# EAGLE design brain (EAGLE 9.5.2)

## Sheet 1 of 2
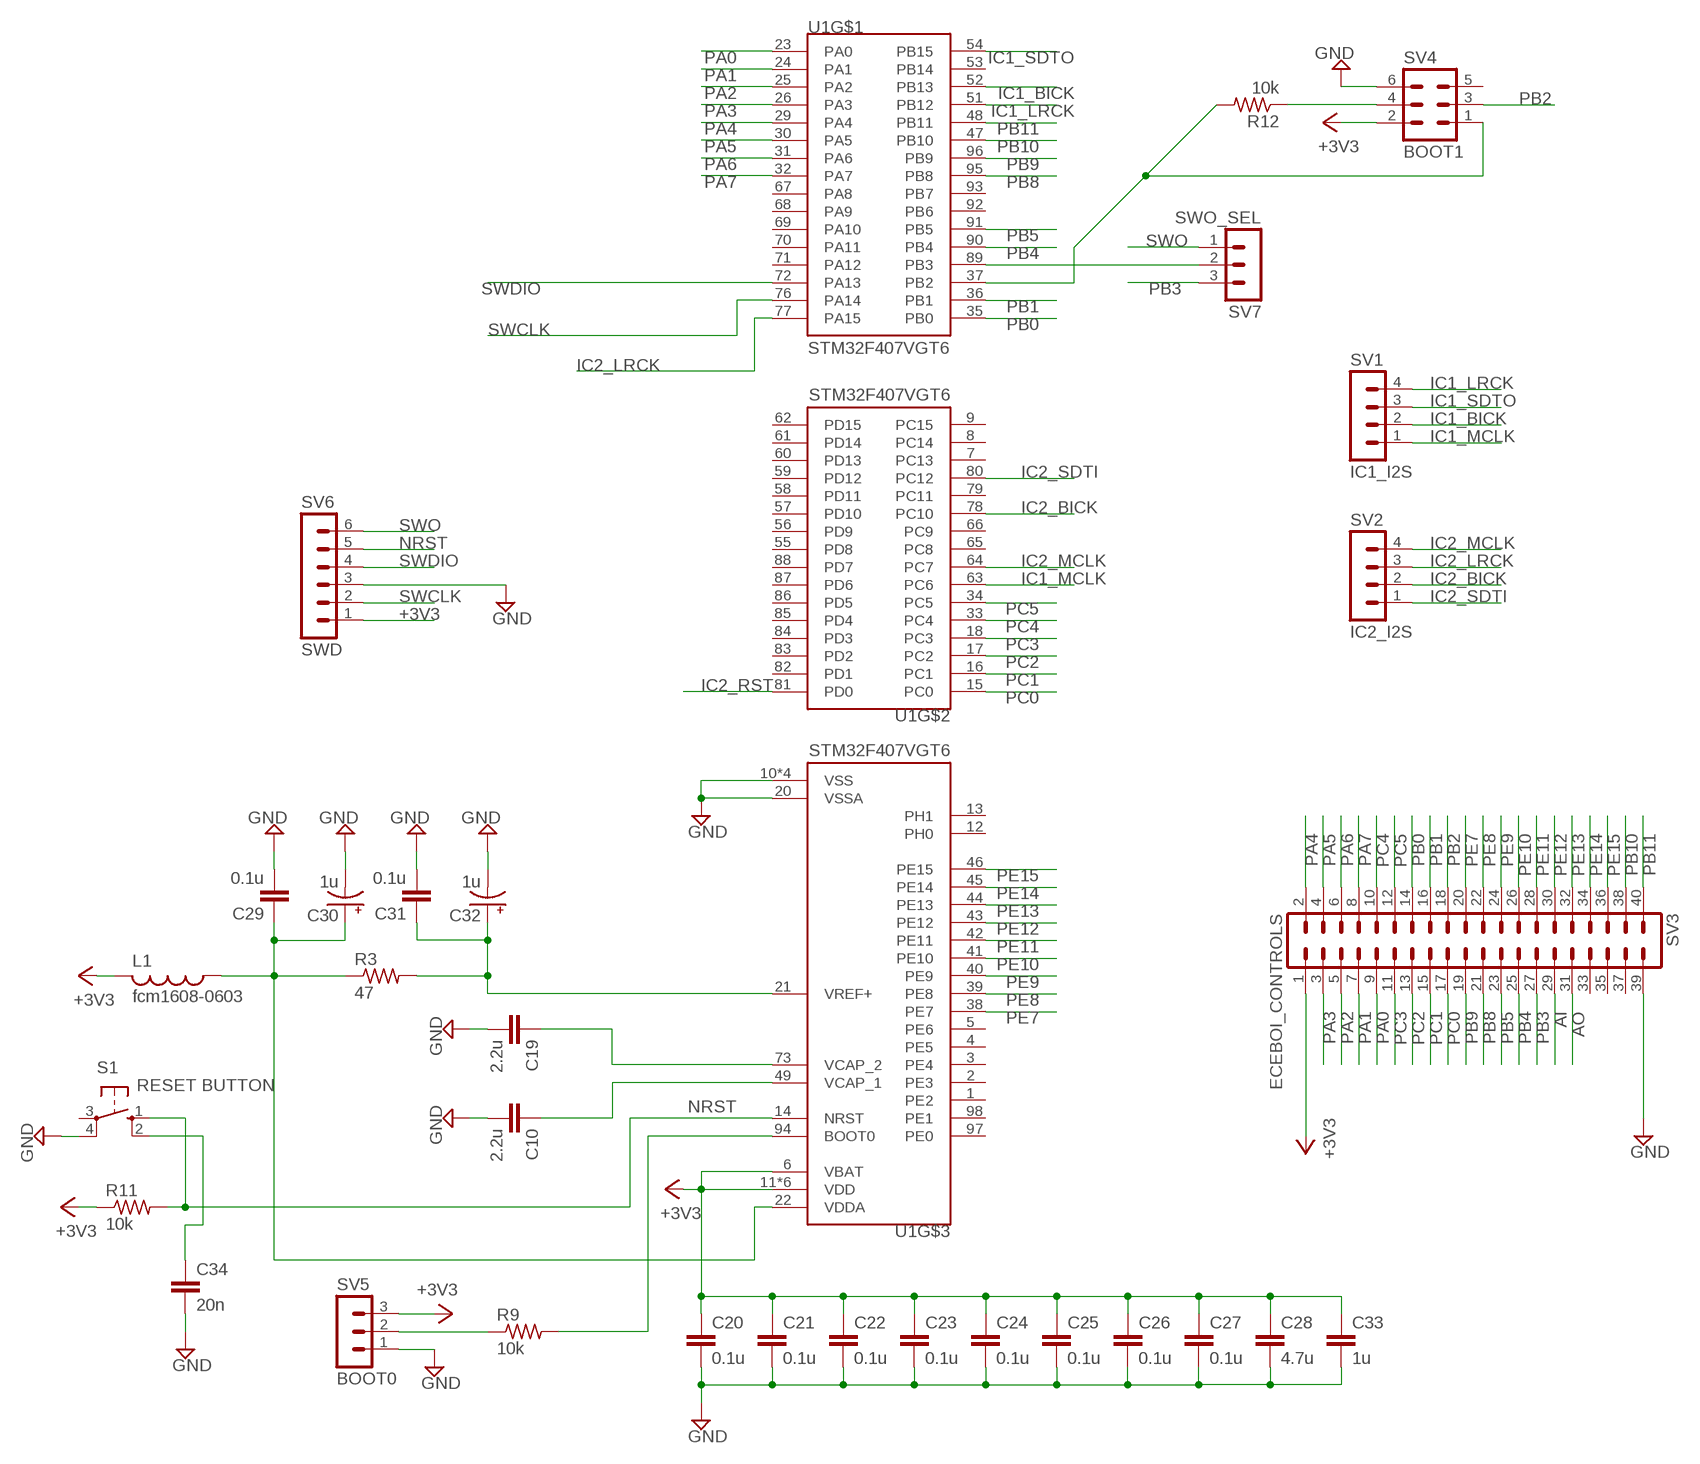
[diagram p0: schematic, sheet 1]

### Parts
C10  2.2u  C-EU025-024X044  [C025-024X044]
C19  2.2u  C-EU025-024X044  [C025-024X044]
C20  0.1u  C-EU025-024X044  [C025-024X044]
C21  0.1u  C-EU025-024X044  [C025-024X044]
C22  0.1u  C-EU025-024X044  [C025-024X044]
C23  0.1u  C-EU025-024X044  [C025-024X044]
C24  0.1u  C-EU025-024X044  [C025-024X044]
C25  0.1u  C-EU025-024X044  [C025-024X044]
C26  0.1u  C-EU025-024X044  [C025-024X044]
C27  0.1u  C-EU025-024X044  [C025-024X044]
C28  4.7u  C-EU025-024X044  [C025-024X044]
C29  0.1u  C-EU025-024X044  [C025-024X044]
C30  1u  CPOL-USE2-5  [E2-5]
C31  0.1u  C-EU025-024X044  [C025-024X044]
C32  1u  CPOL-USE2-5  [E2-5]
C33  1u  C-EU025-024X044  [C025-024X044]
C34  20n  C-EU025-024X044  [C025-024X044]
L1  fcm1608-0603  L-US0207/10  [0207/10]
R3  47  R-US_0207/10  [0207/10]
R9  10k  R-US_0207/10  [0207/10]
R11  10k  R-US_0207/10  [0207/10]
R12  10k  R-US_0207/10  [0207/10]
S1  RESET BUTTON  10-XX  [B3F-10XX]
SV1  IC1_I2S  MA04-1  [MA04-1]
SV2  IC2_I2S  MA04-1  [MA04-1]
SV3  ECEBOI_CONTROLS  MA20-2  [MA20-2]
SV4  BOOT1  MA03-2  [MA03-2]
SV5  BOOT0  MA03-1  [MA03-1]
SV6  SWD  MA06-1  [MA06-1]
SV7  SWO_SEL  MA03-1  [MA03-1]
U1  STM32F407VGT6  [QFP50P1600X1600X160-100N]

### Nets
+3V3: C20.1 C21.1 C22.1 C23.1 C24.1 C25.1 C26.1 C27.1 C28.1 C33.1 L1.2 R11.1 SV3.1 SV4.2 SV5.3 SV6.1 U1.6(VBAT) U1.11(VDD) U1.19(VDD) U1.28(VDD) U1.50(VDD) U1.75(VDD) U1.100(VDD) ; also sheet 2
AI: SV3.29 ; also sheet 2
AO: SV3.31 ; also sheet 2
GND: C10.2 C19.2 C20.2 C21.2 C22.2 C23.2 C24.2 C25.2 C26.2 C27.2 C28.2 C29.2 C30.- C31.2 C32.- C33.2 C34.2 S1.4(P1) SV3.39 SV4.6 SV5.1 SV6.3 U1.10(VSS) U1.20(VSSA) U1.27(VSS) U1.74(VSS) U1.99(VSS) ; also sheet 2
IC1_BICK: SV1.2 U1.52(PB13) ; also sheet 2
IC1_LRCK: SV1.4 U1.51(PB12) ; also sheet 2
IC1_MCLK: SV1.1 U1.63(PC6) ; also sheet 2
IC1_SDTO: SV1.3 U1.54(PB15) ; also sheet 2
IC2_BICK: SV2.2 U1.78(PC10) ; also sheet 2
IC2_LRCK: SV2.3 U1.77(PA15) ; also sheet 2
IC2_MCLK: SV2.4 U1.64(PC7) ; also sheet 2
IC2_RST: U1.81(PD0) ; also sheet 2
IC2_SDTI: SV2.1 U1.80(PC12) ; also sheet 2
N$9: R12.1 SV4.4
N$12: C10.1 U1.49(VCAP_1)
N$13: C19.1 U1.73(VCAP_2)
N$14: C29.1 C30.+ L1.1 R3.1 U1.22(VDDA)
N$15: C31.1 C32.+ R3.2 U1.21(VREF+)
N$19: R12.2 SV4.1 U1.37(PB2)
N$20: R9.1 SV5.2
N$21: R9.2 U1.94(BOOT0)
N$23: C34.1 S1.2(S1)
N$24: SV7.2 U1.89(PB3)
NRST: R11.2 S1.1(S) SV6.5 U1.14(NRST)
PA0: SV3.9 U1.23(PA0)
PA1: SV3.7 U1.24(PA1)
PA2: SV3.5 U1.25(PA2)
PA3: SV3.3 U1.26(PA3)
PA4: SV3.2 U1.29(PA4)
PA5: SV3.4 U1.30(PA5)
PA6: SV3.6 U1.31(PA6)
PA7: SV3.8 U1.32(PA7)
PB0: SV3.14 U1.35(PB0)
PB1: SV3.16 U1.36(PB1)
PB2: SV3.18 SV4.3
PB3: SV3.27 SV7.3
PB4: SV3.25 U1.90(PB4)
PB5: SV3.23 U1.91(PB5)
PB8: SV3.21 U1.95(PB8)
PB9: SV3.19 U1.96(PB9)
PB10: SV3.38 U1.47(PB10)
PB11: SV3.40 U1.48(PB11)
PC0: SV3.17 U1.15(PC0)
PC1: SV3.15 U1.16(PC1)
PC2: SV3.13 U1.17(PC2)
PC3: SV3.11 U1.18(PC3)
PC4: SV3.10 U1.33(PC4)
PC5: SV3.12 U1.34(PC5)
PE7: SV3.20 U1.38(PE7)
PE8: SV3.22 U1.39(PE8)
PE9: SV3.24 U1.40(PE9)
PE10: SV3.26 U1.41(PE10)
PE11: SV3.28 U1.42(PE11)
PE12: SV3.30 U1.43(PE12)
PE13: SV3.32 U1.44(PE13)
PE14: SV3.34 U1.45(PE14)
PE15: SV3.36 U1.46(PE15)
SWCLK: SV6.2 U1.76(PA14)
SWDIO: SV6.4 U1.72(PA13)
SWO: SV6.6 SV7.1
Unconnected: S1.3(P) SV3.33 SV3.35 SV3.37 SV4.5 U1.1(PE2) U1.2(PE3) U1.3(PE4) U1.4(PE5) U1.5(PE6) U1.7(PC13) U1.8(PC14) U1.9(PC15) U1.12(PH0) U1.13(PH1) U1.53(PB14) U1.55(PD8) U1.56(PD9) U1.57(PD10) U1.58(PD11) U1.59(PD12) U1.60(PD13) U1.61(PD14) U1.62(PD15) U1.65(PC8) U1.66(PC9) U1.67(PA8) U1.68(PA9) U1.69(PA10) U1.70(PA11) U1.71(PA12) U1.79(PC11) U1.82(PD1) U1.83(PD2) U1.84(PD3) U1.85(PD4) U1.86(PD5) U1.87(PD6) U1.88(PD7) U1.92(PB6) U1.93(PB7) U1.97(PE0) U1.98(PE1)

## Sheet 2 of 2
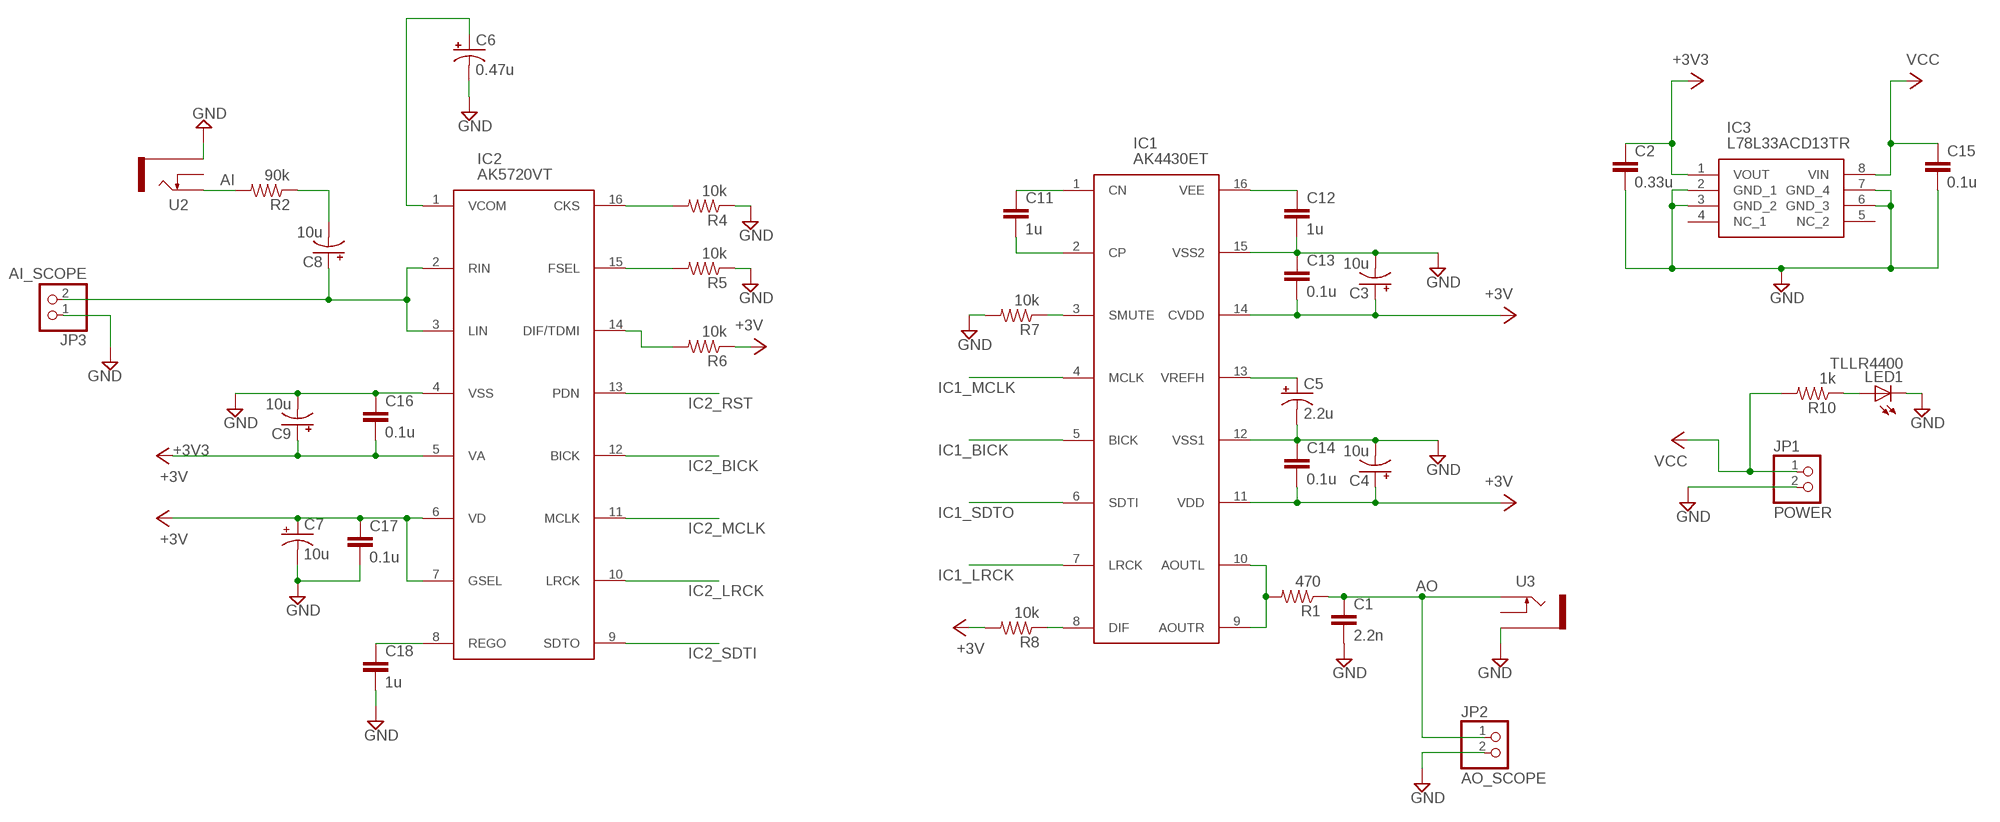
[diagram p1: schematic, sheet 2]

### Parts
C1  2.2n  C-EU025-024X044  [C025-024X044]
C2  0.33u  C-EU025-024X044  [C025-024X044]
C3  10u  CPOL-USE2-5  [E2-5]
C4  10u  CPOL-USE2-5  [E2-5]
C5  2.2u  CPOL-USE2-5  [E2-5]
C6  0.47u  CPOL-USE2-5  [E2-5]
C7  10u  CPOL-USE2-5  [E2-5]
C8  10u  CPOL-USE2-5  [E2-5]
C9  10u  CPOL-USE2-5  [E2-5]
C11  1u  C-EU025-024X044  [C025-024X044]
C12  1u  C-EU025-024X044  [C025-024X044]
C13  0.1u  C-EU025-024X044  [C025-024X044]
C14  0.1u  C-EU025-024X044  [C025-024X044]
C15  0.1u  C-EU025-024X044  [C025-024X044]
C16  0.1u  C-EU025-024X044  [C025-024X044]
C17  0.1u  C-EU025-024X044  [C025-024X044]
C18  1u  C-EU025-024X044  [C025-024X044]
IC1  AK4430ET  [SOP65P640X110-16N]
IC2  AK5720VT  [SOP65P640X110-16N]
IC3  L78L33ACD13TR  [SOIC127P600X175-8N]
JP1  POWER  PINHD-1X2  [1X02]
JP2  AO_SCOPE  PINHD-1X2  [1X02]
JP3  AI_SCOPE  PINHD-1X2  [1X02]
LED1  TLLR4400  [LED3MM]
R1  470  R-US_0207/10  [0207/10]
R2  90k  R-US_0207/10  [0207/10]
R4  10k  R-US_0207/10  [0207/10]
R5  10k  R-US_0207/10  [0207/10]
R6  10k  R-US_0207/10  [0207/10]
R7  10k  R-US_0207/10  [0207/10]
R8  10k  R-US_0207/10  [0207/10]
R10  1k  R-US_0207/10  [0207/10]
U2  THONKICONNNEW  [WQP-PJ301M-12_JACK]
U3  THONKICONNNEW  [WQP-PJ301M-12_JACK]

### Nets
+3V3: C2.1 C3.+ C4.+ C7.+ C9.+ C13.2 C14.2 C16.2 C17.1 IC1.11(VDD) IC1.14(CVDD) IC2.5(VA) IC2.6(VD) IC2.7(GSEL) IC3.1(VOUT) R6.1 R8.2 ; supply symbol labelled +3V ; also sheet 1
AI: R2.2 U2.P$1_TIP(TIP) ; also sheet 1
AO: C1.1 JP2.1 R1.1 U3.P$1_TIP(TIP) ; also sheet 1
DIF: IC2.14(DIF/TDMI) R6.2
GND: C1.2 C2.2 C3.- C4.- C5.- C6.- C7.- C9.- C12.2 C13.1 C14.1 C15.2 C16.1 C17.2 C18.2 IC1.12(VSS1) IC1.15(VSS2) IC2.4(VSS) IC3.2(GND_1) IC3.3(GND_2) IC3.6(GND_3) IC3.7(GND_4) JP1.2 JP2.2 JP3.1 LED1.K(C) R4.1 R5.1 R7.2 U2.P$3_SLEEVE(SLEEVE) U3.P$3_SLEEVE(SLEEVE) ; also sheet 1
IC1_BICK: IC1.5(BICK) ; also sheet 1
IC1_LRCK: IC1.7(LRCK) ; also sheet 1
IC1_MCLK: IC1.4(MCLK) ; also sheet 1
IC1_SDTO: IC1.6(SDTI) ; also sheet 1
IC2_BICK: IC2.12(BICK) ; also sheet 1
IC2_LRCK: IC2.10(LRCK) ; also sheet 1
IC2_MCLK: IC2.11(MCLK) ; also sheet 1
IC2_RST: IC2.13(PDN) ; also sheet 1
IC2_SDTI: IC2.9(SDTO) ; also sheet 1
N$1: C12.1 IC1.16(VEE)
N$2: C18.1 IC2.8(REGO)
N$3: C11.1 IC1.1(CN)
N$4: C11.2 IC1.2(CP)
N$5: C8.+ IC2.2(RIN) IC2.3(LIN) JP3.2
N$6: C6.+ IC2.1(VCOM)
N$7: IC1.9(AOUTR) IC1.10(AOUTL) R1.2
N$8: C5.+ IC1.13(VREFH)
N$10: C8.- R2.1
N$11: IC2.16(CKS) R4.2
N$16: IC2.15(FSEL) R5.2
N$17: IC1.8(DIF) R8.1
N$18: IC1.3(SMUTE) R7.1
N$22: LED1.A R10.1
VCC: C15.1 IC3.8(VIN) JP1.1 R10.2
Unconnected: IC3.4(NC_1) IC3.5(NC_2) U2.P$2_SWITCH(SWITCH) U3.P$2_SWITCH(SWITCH)

## Library data of the parts
C1 C2 C10-C29 C31 C33 C34 = rcl:C-EU: CAPACITOR, European symbol
C3-C9 C30 C32 = rcl:CPOL-US: POLARIZED CAPACITOR, American symbol
IC1 = AK4430ET:AK4430ET: DAC 2-CH Delta-Sigma 24-bit 16-Pin TSSOP Source: Datasheet <https://www.arrow.com/en/products/ak4430et/asahi-kasei-microdevices-corporation>; DESCRIPTION: DAC 2-CH Delta-Sigma 24-bit 16-Pin TSSOP; HEIGHT: 1.1mm; MANUFACTURER_NAME: AKM; MANUFACTURER_PART_NUMBER: AK4430ET
IC2 = AK5720VT:AK5720VT: 24-bit Audio ADC Source: Datasheet <http://www.akm.com/akm/en/file/datasheet/AK5720VT.pdf>; DESCRIPTION: 24-bit Audio ADC; HEIGHT: 1.1mm; MANUFACTURER_NAME: AKM; MANUFACTURER_PART_NUMBER: AK5720VT
IC3 = L78L33ACD13TR:L78L33ACD13TR: STMICROELECTRONICS - L78L33ACD13TR - Linear Voltage Regulators, Fixed, 8.3V To 30V In, 3.3V And 0.1A Out, SOIC-8 Source: Datasheet <https://componentsearchengine.com/Datasheets/2/L78L33ACD13TR.pdf>; DESCRIPTION: STMICROELECTRONICS - L78L33ACD13TR - Linear Voltage Regulators, Fixed, 8.3V To 30V In, 3.3V And 0.1A Out, SOIC-8; HEIGHT: 1.75mm; MANUFACTURER_NAME: STMicroelectronics; MANUFACTURER_PART_NUMBER: L78L33ACD13TR
JP1-JP3 = pinhead:PINHD-1X2: PIN HEADER
L1 = rcl:L-US: INDUCTOR, American symbol
LED1 = led:TLLR4400: Low Current (2mA) LED 3 mm Tinted Diffused Package color RED Source: Data sheet <http://www.farnell.com/datasheets/391100.pdf>; MF: VISHAY SEMICONDUCTOR; OC_FARNELL: 1612437
R1-R12 = rcl:R-US_: RESISTOR, American symbol
S1 = switch-omron:10-XX: OMRON SWITCH; MPN: B3F-1000; OC_FARNELL: 176432; OC_NEWARK: 36M3542
SV1 SV2 = con-lstb:MA04-1: PIN HEADER; OC_FARNELL: unknown; OC_NEWARK: unknown
SV3 = con-lstb:MA20-2: PIN HEADER; OC_FARNELL: unknown; OC_NEWARK: unknown
SV4 = con-lstb:MA03-2: PIN HEADER; OC_FARNELL: unknown; OC_NEWARK: unknown
SV5 SV7 = con-lstb:MA03-1: PIN HEADER; OC_FARNELL: unknown; OC_NEWARK: unknown
SV6 = con-lstb:MA06-1: PIN HEADER; OC_FARNELL: unknown; OC_NEWARK: unknown
U1 = STM32F407VGT6:STM32F407VGT6: STM32 Series 32-bit 1 MB Flash 192 kB RAM ARM Based Microcontroller - LQFP-100; DESCRIPTION: STM32 Series 32-bit 1 MB Flash 192 kB RAM ARM Based Microcontroller - LQFP-100; DIGI-KEY_PART_NUMBER: 497-11605-ND; DIGI-KEY_PURCHASE_URL: https://www.digikey.com/product-detail/en/stmicroelectronics/STM32F407VGT6/497-11605-ND/2747117?utm_source=snapeda&utm_medium=aggregator&utm_campaign=symbol; MF: STMicroelectronics; MP: STM32F407VGT6; PACKAGE: LQFP-100 STMicroelectronics
U2 U3 = MusicThingModular:THONKICONN: 3.5mm socket for Eurorack modular synths

## Board
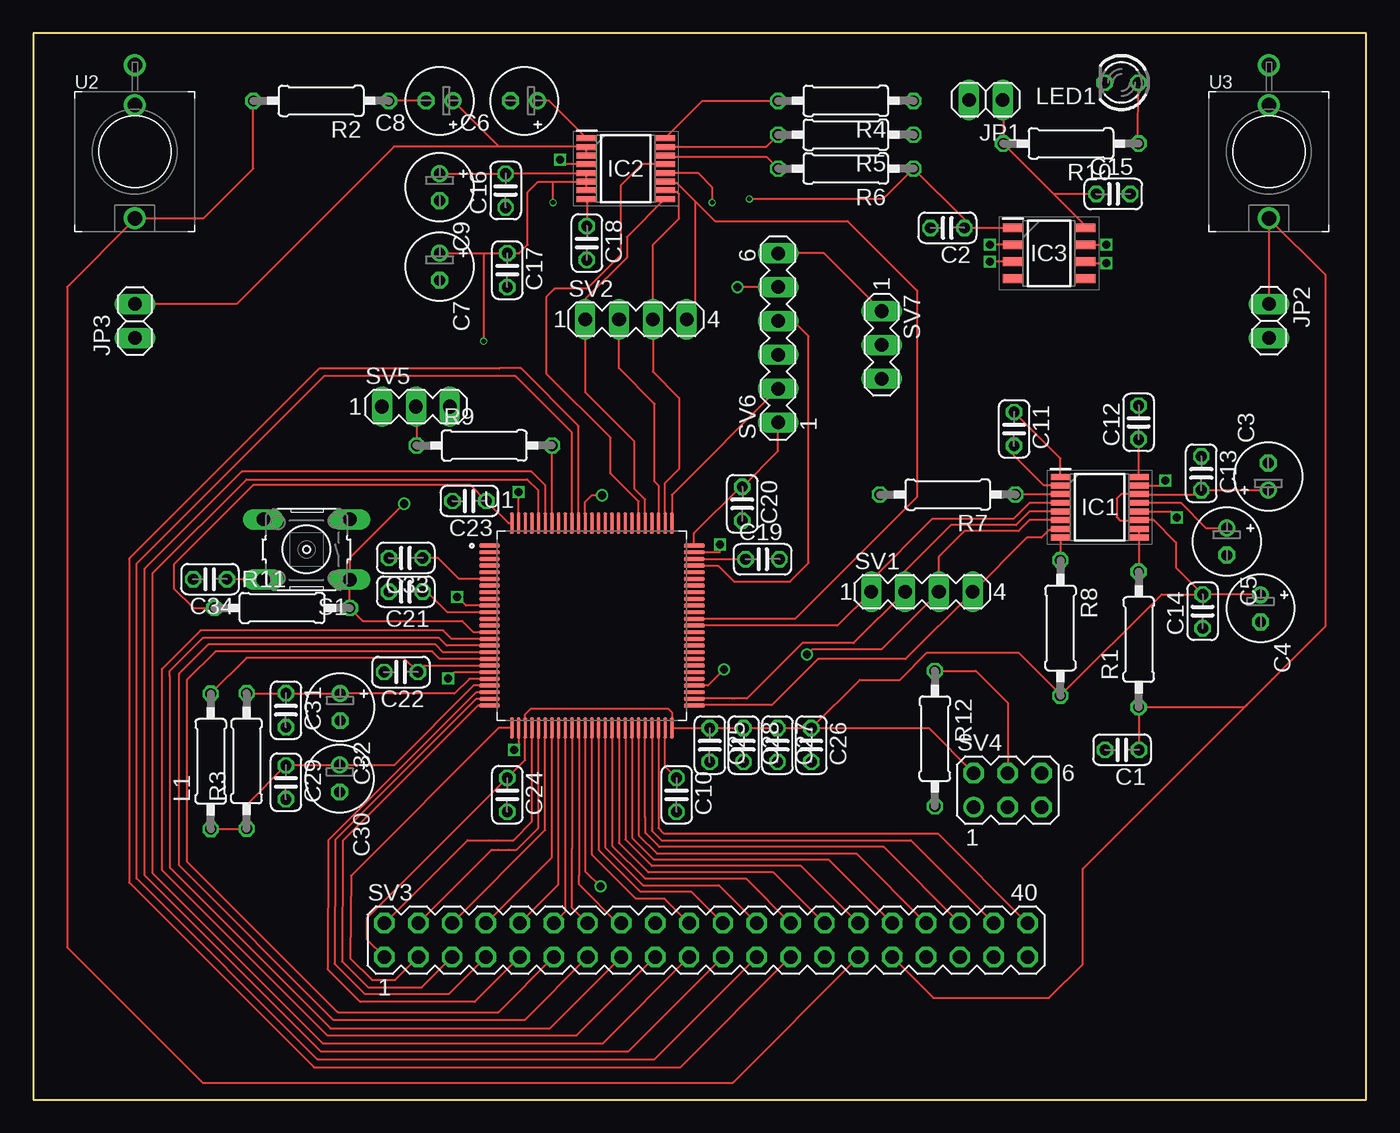
[diagram p2: board, top side]
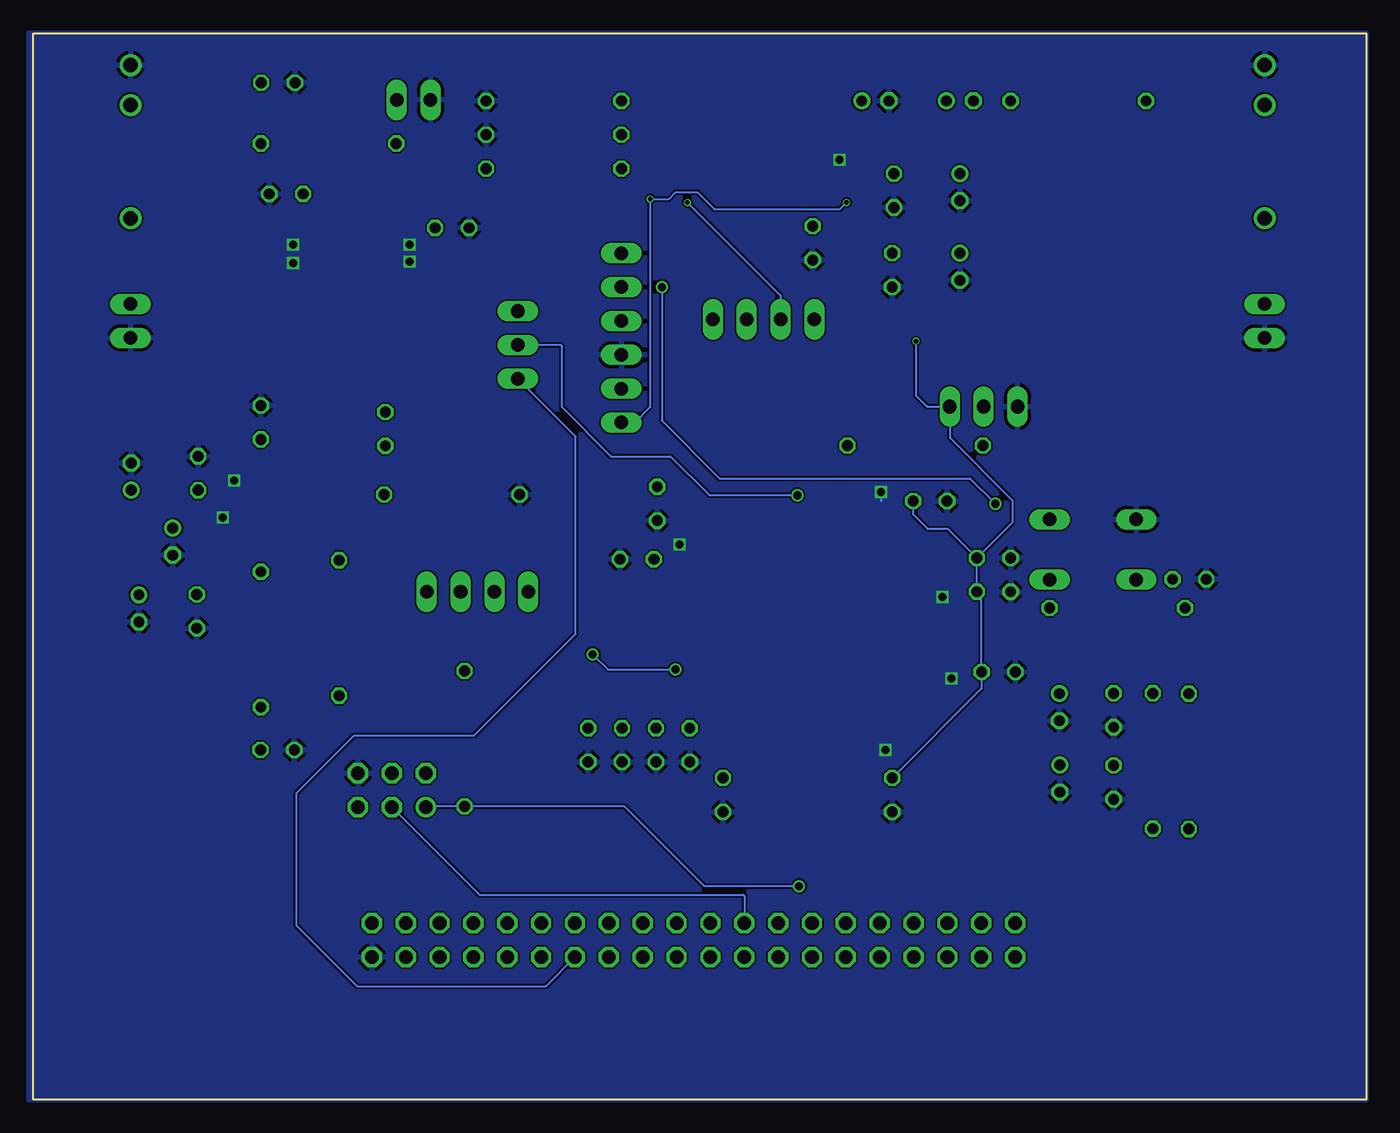
[diagram p3: board, bottom side, seen from below]

Size 100 x 80 mm. Coordinates in mm from the lower left corner, seen from the top.
Outline: 0,0 100,0 100,80 0,80 0,0
Copper layers (1*16): Top 0.035mm / dielectric 1.5mm / Bottom 0.035mm
Design rules "default *": minimum track width 5mil, minimum drill 0.2mm, track to track 5mil, track to pad 5mil, pad to pad 5mil, via to via 5mil, smd to smd 5mil, copper to edge 0mil, drill to drill 5mil, minimum pad ring 3mil, minimum via ring 3mil, stop-mask expansion 4mil, vias tented up to drill 0mil, thermal gap 10mil

### Footprints (pad centres in the part's own frame; a part is rotated, then mirrored left to right if it is on the bottom)
C025-024X044 = drill 0.813 octagon: 1 -1.27,0; 2 1.27,0
E2-5 = drill 0.813 pad 1.27: + -1.016,0 | drill 0.813 pad 1.27 octagon: - 1.016,0
SOP65P640X110-16N = smd 1.475 x 0.45: 1 -2.938,2.275; 2 -2.938,1.625; 3 -2.938,0.975; 4 -2.938,0.325; 5 -2.938,-0.325; 6 -2.938,-0.975; 7 -2.938,-1.625; 8 -2.938,-2.275; 9 2.938,-2.275; 10 2.938,-1.625; 11 2.938,-0.975; 12 2.938,-0.325; 13 2.938,0.325; 14 2.938,0.975; 15 2.938,1.625; 16 2.938,2.275
SOIC127P600X175-8N = smd 1.525 x 0.65: 1 -2.712,1.905; 2 -2.712,0.635; 3 -2.712,-0.635; 4 -2.712,-1.905; 5 2.712,-1.905; 6 2.712,-0.635; 7 2.712,0.635; 8 2.712,1.905
1X02 = drill 1.016 long: 1 -1.27,0; 2 1.27,0
0207/10 = drill 0.813 octagon: 1 -5.08,0; 2 5.08,0
LED3MM = drill 0.813 octagon: A -1.27,0; K 1.27,0
B3F-10XX = drill 1.016 long: 1 -3.251,2.261; 2 3.251,2.261; 3 -3.251,-2.261; 4 3.251,-2.261
MA04-1 = drill 1.016 long: 1 -3.81,0; 2 -1.27,0; 3 1.27,0; 4 3.81,0
MA20-2 = drill 1.016 octagon: 1 -24.13,-1.27; 2 -24.13,1.27; 3 -21.59,-1.27; 4 -21.59,1.27; 5 -19.05,-1.27; 6 -19.05,1.27; 7 -16.51,-1.27; 8 -16.51,1.27; 9 -13.97,-1.27; 10 -13.97,1.27; 11 -11.43,-1.27; 12 -11.43,1.27; 13 -8.89,-1.27; 14 -8.89,1.27; 15 -6.35,-1.27; 16 -6.35,1.27; 17 -3.81,-1.27; 18 -3.81,1.27; 19 -1.27,-1.27; 20 -1.27,1.27; 21 1.27,-1.27; 22 1.27,1.27; 23 3.81,-1.27; 24 3.81,1.27; 25 6.35,-1.27; 26 6.35,1.27; 27 8.89,-1.27; 28 8.89,1.27; 29 11.43,-1.27; 30 11.43,1.27; 31 13.97,-1.27; 32 13.97,1.27; 33 16.51,-1.27; 34 16.51,1.27; 35 19.05,-1.27; 36 19.05,1.27; 37 21.59,-1.27; 38 21.59,1.27; 39 24.13,-1.27; 40 24.13,1.27
MA03-2 = drill 1.016: 1 -2.54,-1.27 | drill 1.016 octagon: 2 -2.54,1.27; 3 0,-1.27; 4 0,1.27; 5 2.54,-1.27; 6 2.54,1.27
MA03-1 = drill 1.016 long: 1 -2.54,0; 2 0,0; 3 2.54,0
MA06-1 = drill 1.016 long: 1 -6.35,0; 2 -3.81,0; 3 -1.27,0; 4 1.27,0; 5 3.81,0; 6 6.35,0
QFP50P1600X1600X160-100N = smd 1.56 x 0.28: 1 -7.68,6; 2 -7.68,5.5; 3 -7.68,5; 4 -7.68,4.5; 5 -7.68,4; 6 -7.68,3.5; 7 -7.68,3; 8 -7.68,2.5; 9 -7.68,2; 10 -7.68,1.5; 11 -7.68,1; 12 -7.68,0.5; 13 -7.68,0; 14 -7.68,-0.5; 15 -7.68,-1; 16 -7.68,-1.5; 17 -7.68,-2; 18 -7.68,-2.5; 19 -7.68,-3; 20 -7.68,-3.5; 21 -7.68,-4; 22 -7.68,-4.5; 23 -7.68,-5; 24 -7.68,-5.5; 25 -7.68,-6; 51 7.68,-6; 52 7.68,-5.5; 53 7.68,-5; 54 7.68,-4.5; 55 7.68,-4; 56 7.68,-3.5; 57 7.68,-3; 58 7.68,-2.5; 59 7.68,-2; 60 7.68,-1.5; 61 7.68,-1; 62 7.68,-0.5; 63 7.68,0; 64 7.68,0.5; 65 7.68,1; 66 7.68,1.5; 67 7.68,2; 68 7.68,2.5; 69 7.68,3; 70 7.68,3.5; 71 7.68,4; 72 7.68,4.5; 73 7.68,5; 74 7.68,5.5; 75 7.68,6 | smd 0.28 x 1.56: 26 -6,-7.68; 27 -5.5,-7.68; 28 -5,-7.68; 29 -4.5,-7.68; 30 -4,-7.68; 31 -3.5,-7.68; 32 -3,-7.68; 33 -2.5,-7.68; 34 -2,-7.68; 35 -1.5,-7.68; 36 -1,-7.68; 37 -0.5,-7.68; 38 0,-7.68; 39 0.5,-7.68; 40 1,-7.68; 41 1.5,-7.68; 42 2,-7.68; 43 2.5,-7.68; 44 3,-7.68; 45 3.5,-7.68; 46 4,-7.68; 47 4.5,-7.68; 48 5,-7.68; 49 5.5,-7.68; 50 6,-7.68; 76 6,7.68; 77 5.5,7.68; 78 5,7.68; 79 4.5,7.68; 80 4,7.68; 81 3.5,7.68; 82 3,7.68; 83 2.5,7.68; 84 2,7.68; 85 1.5,7.68; 86 1,7.68; 87 0.5,7.68; 88 0,7.68; 89 -0.5,7.68; 90 -1,7.68; 91 -1.5,7.68; 92 -2,7.68; 93 -2.5,7.68; 94 -3,7.68; 95 -3.5,7.68; 96 -4,7.68; 97 -4.5,7.68; 98 -5,7.68; 99 -5.5,7.68; 100 -6,7.68
WQP-PJ301M-12_JACK = drill 1.1: P$1_TIP 0,5; P$2_SWITCH 0,-3.5; P$3_SLEEVE 0,-6.5

### Placement (x,y rotation side)
C1  81.69,26.24 180 top
C2  68.58,65.41 180 top
C3  92.66,46.74 90 top
C4  92.08,36.86 270 top
C5  89.53,41.86 270 top
C6  36.83,74.93 180 top
C7  30.48,62.48 270 top
C8  30.48,74.93 180 top
C9  30.48,68.45 270 top
C10  48.26,22.86 270 top
C11  73.58,50.32 270 top
C12  82.93,50.8 90 top
C13  87.63,46.99 270 top
C14  87.73,36.63 90 top
C15  81.03,67.94 0 top
C16  35.43,68.2 90 top
C17  35.56,62.23 270 top
C18  41.53,64.26 270 top
C19  54.71,40.54 0 top
C20  53.19,44.7 270 top
C21  27.94,38.1 180 top
C22  27.58,32.08 180 top
C23  32.72,44.91 180 top
C24  35.56,22.86 270 top
C25  50.75,26.59 270 top
C26  58.37,26.59 270 top
C27  55.83,26.59 270 top
C28  53.29,26.59 270 top
C29  18.95,23.8 270 top
C30  22.99,24.08 270 top
C31  18.95,29.21 270 top
C32  23.01,29.44 270 top
C33  27.94,40.64 180 top
C34  13.26,39.04 180 top
IC1  80.01,44.45 0 top
IC2  44.45,69.85 0 top
IC3  76.2,63.5 0 top
JP1  71.47,75.01 180 top
JP2  92.71,58.42 270 top
JP3  7.62,58.42 90 top
L1  13.31,25.37 90 top
LED1  81.64,76.3 180 top
R1  82.93,34.52 90 top
R2  21.59,74.93 180 top
R3  16,25.4 90 top
R4  60.96,74.93 180 top
R5  60.96,72.39 180 top
R6  60.96,69.85 180 top
R7  68.61,45.39 180 top
R8  77.06,35.38 270 top
R9  33.83,49.07 0 top
R10  77.85,71.73 180 top
R11  18.67,36.88 0 top
R12  67.64,27.08 270 top
S1  20.5,41.27 180 top
SV1  66.67,38.1 0 top
SV2  45.21,58.55 0 top
SV3  50.47,11.96 0 top
SV4  73.1,23.22 0 top
SV5  28.7,51.99 0 top
SV6  55.88,57.15 90 top
SV7  63.65,56.62 270 top
U1  41.91,35.56 0 top
U2  7.62,71.12 180 top
U3  92.71,71.12 180 top

### Tracks (layer width: path | path; a pad name or v marks a point on that pad's centre or on a via)
+3V3  (via drill 0.35)
  Top 0.152: IC3.1 C2.1 69.85,66.04 R6.1 63.75,67.56 v53.72,67.56 | C26.1 C27.1 C28.1 C25.1 50.73,27.88 U1.50 47.91,29.05 47.62,29.34 37.34,29.34 36.91,28.91 U1.28 36.91,25.48 C24.1 25.02,13.59 25.02,12.01 SV3.1 | U1.75 49.58,42.49 53.06,45.97 C20.1 55.88,48.67 SV6.1 | U1.100 35.65,43.24 C23.1 32.79,46.1 16.51,46.1 10.54,40.13 10.54,38.35 12.01,36.88 R11.1 | U1.6 31.93,39.06 30.35,40.64 C33.1 | U1.11 31.09,36.55 29.54,38.1 C21.1 | U1.19 29.31,32.56 C22.1 27.79,33.15 16,33.15 L1.2 | C9.+ C16.2 41.46,69.47 IC2.5 IC2.6 | C7.+ 33.78,63.5 | 33.78,63.5 C17.1 36.45,63.5 37.08,64.14 37.08,68.07 37.85,68.83 38.99,68.83 | IC2.6 41.47,68.83 38.99,68.83 | IC2.7 IC2.6 | C3.+ C13.2 87.55,45.72 87.22,45.39 82.98,45.39 IC1.14 81.62,45.42 81.28,45.09 81.28,43.69 81.53,43.43 82.91,43.43 IC1.11 82.98,43.51 84.02,43.51 85.72,41.81 85.72,39.9 C14.2 | C4.+ 92.05,37.9 C14.2 | C26.1 67.18,27.86 SV4.2 | R8.2 77.1,30.34 | 77.1,30.34 84.66,37.9 C14.2 | v38.99,67.31 38.99,68.83 | 33.78,63.5 v33.78,56.9 | C26.1 62,31.5 65.02,31.5 67.06,33.53 73.91,33.53 77.1,30.34
  Bottom 0.152: SV6.1 54.86,50.8 53.72,51.94 v53.72,67.56 52.32,67.56 51.82,68.07 50.16,68.07 48.9,66.8 39.5,66.8 v38.99,67.31 | v33.78,56.9 33.78,52.83 32.94,51.99 SV5.3 31.24,49.66 26.54,44.96 26.54,43.31 C33.1 | C33.1 31.37,42.8 32.89,42.8 33.98,43.89 C23.1 | C21.1 29.21,38.23 | 29.21,38.23 C33.1 | 29.21,38.23 28.85,37.87 C22.1 28.85,30.84 C24.1
AI
  Top 0.152: SV3.29 52.48,1.27 12.7,1.27 2.54,11.43 2.54,60.96 7.62,66.04 U2.P$1_TIP 12.78,66.12 16.51,69.85 R2.2
AO
  Top 0.152: 91.03,29.62 90.86,29.44 R1.1 82.96,29.41 C1.1 | SV3.31 67.51,7.62 76.2,7.62 78.74,10.16 78.74,17.32 91.03,29.62 | JP2.1 U3.P$1_TIP 92.71,66.09 96.95,61.85 96.95,35.53 92.94,31.52 91.03,29.62
DIF
  Top 0.152: IC2.14 47.47,70.74 54.99,70.74 R6.2
GND  (via drill 0.6)
  Top 0.152: IC3.2 v71.75,64.14 | IC3.3 v71.75,62.87 | IC3.7 v80.52,64.14 | IC3.6 78.91,62.74 v80.52,62.74 | IC2.4 39.88,70.18 v39.52,70.54 | IC1.15 84.56,46.08 84.91,46.43 v84.94,46.43 | IC1.12 85.32,44.12 v85.78,43.66 | U1.74 49.6,41.07 51.51,41.07 v51.51,41.66 | U1.99 36.4,43.25 v36.4,45.59 | U1.10 32.46,37.06 v31.8,37.72 | U1.27 36.4,27.87 36.4,26.24 v36.07,26.24 | U1.20 31.6,32.06 31.6,32.05 31.57,32.05 v31.11,31.6
  Bottom 0.152: v71.75,64.14 71.63,64.14 | v71.75,62.87 71.63,62.87 | v80.52,64.14 80.64,64.14 | v80.52,62.74 80.64,62.74 | v39.52,70.54 39.52,70.56 | v84.94,46.43 84.96,46.43 | v85.78,43.66 85.83,43.61 | v51.51,41.66 51.33,41.68 | v36.4,45.59 36.4,44.88 | v31.8,37.72 31.8,37.74 | v36.07,26.24 36.04,26.24 | v31.11,31.6 31.09,31.57
  pour Bottom: 0,80.01 100.33,80.01 100.33,0 0,0
IC1_BICK
  Top 0.152: IC1.5 74.74,44.12 73.72,43.1 68.83,43.1 65.41,39.67 SV1.2 61.54,34.24 57.69,34.24 53.54,30.09 52.58,30.09 52.45,30.09 49.62,30.09 U1.52
IC1_LRCK
  Top 0.152: IC1.7 76.98,42.73 76.2,42.73 75.63,42.16 74.55,42.16 SV1.4 65.44,33.05 58.88,33.05 55.41,29.59 49.62,29.59 U1.51
IC1_MCLK
  Top 0.152: IC1.4 74.75,44.77 73.53,43.56 67.44,43.56 62.87,38.99 SV1.1 60.33,35.56 U1.63
IC1_SDTO  (via drill 0.61)
  Top 0.152: IC1.6 74.74,43.48 73.91,42.65 69.85,42.65 67.94,40.74 SV1.3 63.63,33.78 58.42,33.78 v58.04,33.4 | v51.82,32.26 50.62,31.06 U1.54
  Bottom 0.152: v58.04,33.4 56.9,32.26 v51.82,32.26
IC2_BICK  (via drill 0.35)
  Top 0.152: U1.78 46.91,46.05 46.61,46.35 46.61,52.2 43.94,54.86 SV2.2 | IC2.12 49.85,69.53 50.93,68.45 v50.93,67.31
  Bottom 0.152: SV2.2 43.94,60.33 v50.93,67.31
IC2_LRCK
  Top 0.152: IC2.10 47.48,68.13 48.26,68.13 48.46,67.94 48.46,66.11 46.48,64.14 SV2.3 46.48,54.61 48.46,52.64 48.46,47.31 47.37,46.23 47.37,44.12 47.38,44.12 47.38,43.27 U1.77
IC2_MCLK
  Top 0.152: IC2.11 47.48,68.78 48.26,68.78 49.63,67.41 | 49.63,67.41 51.13,65.91 61.09,65.91 66.29,60.71 66.29,45.21 57.14,36.06 U1.64 | 49.63,67.41 49.63,59.16 SV2.4
IC2_RST
  Top 0.152: U1.81 45.41,44.88 43.31,46.98 43.31,49.66 38.48,54.48 38.48,60.2 39.12,60.83 41.53,60.83 44.07,63.37 44.07,68.58 45.66,70.17 IC2.13
IC2_SDTI
  Top 0.152: U1.80 45.91,45.02 45.09,45.85 45.09,49.4 41.4,53.09 SV2.1 41.4,60.06 44.53,63.18 44.53,64.71 IC2.9
N$1
  Top 0.152: IC1.16 82.93,46.74 C12.1
N$2
  Top 0.152: IC2.8 41.53,67.56 C18.1
N$3
  Top 0.152: IC1.1 77.06,48.11 C11.1
N$4
  Top 0.152: IC1.2 75.82,46.08 73.58,48.31 C11.2
N$5
  Top 0.152: 35.56,71.5 41.49,71.5 IC2.2 IC2.3 | 35.56,71.5 34.92,71.5 C8.+ | 35.56,71.5 27.05,71.5 15.24,59.69 JP3.2
N$6
  Top 0.152: IC2.1 38.71,74.93 C6.+
N$7
  Top 0.152: IC1.10 IC1.9 82.93,42.16 R1.2
N$8
  Top 0.152: IC1.13 86.08,44.78 87.99,42.88 C5.+
N$9
  Top 0.152: R12.1 70.71,32.16 73.1,29.77 SV4.4
N$10
  Top 0.152: C8.- R2.1
N$11
  Top 0.152: IC2.16 50.19,74.93 R4.2
N$12
  Top 0.152: C10.1 47.41,24.98 U1.49
N$13
  Top 0.152: U1.73 49.61,40.54 C19.1
N$14
  Top 0.152: C30.+ 22.96,25.07 | 22.96,25.07 C29.1 16,22.12 R3.1 13.34,20.32 L1.1 | 22.96,25.07 27.05,25.07 33.07,31.09 34.2,31.09 U1.22
N$15
  Top 0.152: U1.21 34.22,31.57 32.72,31.57 31.6,30.45 23.52,30.45 C32.+ 18.97,30.45 C31.1 R3.2
N$16
  Top 0.152: IC2.15 47.41,71.5 54.99,71.5 R5.2
N$17
  Top 0.152: IC1.8 77.06,42.17 R8.1
N$18
  Top 0.152: R7.1 73.72,45.42 IC1.3
N$19  (via drill 0.61)
  Top 0.152: U1.37 41.41,17.14 v42.55,16
  Bottom 0.152: v42.55,16 49.66,16 55.65,22 R12.2 70.51,22 SV4.1
N$20
  Top 0.152: SV5.2 28.75,51.94 R9.1
N$21
  Top 0.152: U1.94 R9.2
N$22
  Top 0.152: R10.1 82.88,71.78 LED1.A
N$23
  Top 0.152: C34.1 17.22,39.04 S1.2
N$24  (via drill 0.61)
  Top 0.152: v42.67,45.34 41.91,45.34 41.41,44.84 U1.89
  Bottom 0.152: v42.67,45.34 49.28,45.34 52.2,48.26 56.64,48.26 60.33,51.94 60.33,56.52 60.43,56.62 SV7.2
NRST  (via drill 0.61)
  Top 0.152: U1.14 33.05,35.05 32.18,35.92 24.71,35.92 R11.2 23.75,38.35 | 23.75,38.35 S1.1 | 23.75,38.35 23.75,40.64 v27.81,44.7 | SV6.5 v52.83,60.96
  Bottom 0.152: v52.83,60.96 52.83,50.93 48.51,46.61 29.72,46.61 v27.81,44.7
PA0
  Top 0.152: SV3.9 33.12,7.32 24.54,7.32 22.07,9.78 22.12,18.97 22.12,19.46 33.23,30.56 U1.23
PA1
  Top 0.152: SV3.7 31.17,7.9 24.89,7.9 22.61,10.19 22.66,18.77 22.66,19.48 33.23,30.06 U1.24
PA2
  Top 0.152: SV3.5 29.13,8.41 25.12,8.41 23.16,10.36 23.22,18.55 23.22,19.41 33.37,29.56 U1.25
PA3
  Top 0.152: U1.26 35.89,27.86 34.9,27.86 23.82,16.79 23.77,10.59 25.4,8.97 27.15,8.97 SV3.3
PA4
  Top 0.152: U1.29 37.41,20.85 36.02,19.46 34.82,19.46 34.21,19.46 32.56,19.46 SV3.2
PA5
  Top 0.152: U1.30 37.9,27.87 37.9,20.37 36.27,18.75 35.69,18.75 34.87,18.75 34.39,18.75 SV3.4
PA6
  Top 0.152: U1.31 38.41,20.22 SV3.6
PA7
  Top 0.152: U1.32 38.91,18.19 SV3.8
PB0
  Top 0.152: U1.35 40.41,18.82 40.39,18.8 40.39,14.43 SV3.14
PB1
  Top 0.152: U1.36 40.95,27.84 40.95,16.82 40.95,16.13 43.99,13.08 SV3.16
PB2
  Bottom 0.152: SV4.3 66.52,15.37 46.74,15.37 46.66,15.29 SV3.18
PB3
  Bottom 0.152: SV3.27 61.54,8.51 75.69,8.51 80.26,13.08 80.26,22.99 75.95,27.3 66.93,27.3 59.31,34.92 59.31,49.73 SV7.3
PB4
  Top 0.152: U1.90 40.92,50.52 36.58,54.86 34.98,54.86 34.95,54.84 21.44,54.84 7.19,40.59 7.19,16.28 21.06,2.41 48.54,2.41 SV3.25
PB5
  Top 0.152: U1.91 40.41,50.04 36.17,54.28 21.82,54.28 7.75,40.21 7.75,16.59 21.31,3.02 46.61,3.02 SV3.23
PB8
  Top 0.152: U1.95 38.43,43.26 38.43,46.05 37.36,47.12 15.65,47.12 8.36,39.83 8.36,16.82 21.57,3.61 44.65,3.61 SV3.21
PB9
  Top 0.152: U1.96 37.9,43.25 37.9,45.7 37.06,46.53 16,46.53 8.97,39.5 8.97,16.97 21.74,4.19 42.7,4.19 SV3.19
PB10
  Top 0.152: U1.47 46.41,20.38 46.41,20.37 46.41,20.17 47.12,19.46 65.84,19.46 SV3.38
PB11
  Top 0.152: U1.48 46.91,20.39 46.89,20.37 47.3,19.96 67.87,19.96 SV3.40
PC0
  Top 0.152: U1.15 31.39,34.57 30.76,35.2 12.55,35.2 9.65,32.31 9.65,17.2 22.05,4.8 40.77,4.8 SV3.17
PC1
  Top 0.152: U1.16 31.01,34.06 30.45,34.62 12.7,34.62 10.24,32.16 10.24,31.75 10.26,31.73 10.26,17.37 22.3,5.33 38.76,5.33 SV3.15
PC2
  Top 0.152: U1.17 30.76,33.55 30.18,34.14 13.13,34.14 10.95,31.95 10.95,17.55 22.5,5.99 36.88,5.99 SV3.13
PC3
  Top 0.152: U1.18 30.48,33.07 29.92,33.63 13.66,33.63 11.56,31.52 11.56,17.83 22.84,6.55 34.9,6.55 SV3.11
PC4
  Top 0.152: U1.33 39.4,27.86 39.4,16.13 SV3.10
PC5
  Top 0.152: U1.34 39.9,14.1 SV3.12
PE7
  Top 0.152: U1.38 41.94,27.86 41.94,18.36 45.24,15.06 47.37,15.06 SV3.20
PE8
  Top 0.152: U1.39 42.42,18.75 45.57,15.6 49.38,15.6 SV3.22
PE9
  Top 0.152: U1.40 42.9,18.92 45.74,16.08 51.44,16.08 SV3.24
PE10
  Top 0.152: U1.41 43.43,27.86 43.43,19.05 45.92,16.56 53.49,16.56 SV3.26
PE11
  Top 0.152: U1.42 43.94,27.85 43.94,19.25 46.15,17.04 55.55,17.04 SV3.28
PE12
  Top 0.152: U1.43 44.42,27.86 44.42,19.51 46.41,17.53 57.61,17.53 SV3.30
PE13
  Top 0.152: U1.44 44.93,27.86 44.93,19.63 46.58,17.98 59.69,17.98 SV3.32
PE14
  Top 0.152: U1.45 45.41,19.84 46.79,18.47 61.75,18.47 SV3.34
PE15
  Top 0.152: U1.46 45.91,21.17 45.92,21.16 45.92,19.99 46.97,18.95 63.8,18.95 SV3.36
SWCLK
  Top 0.152: SV6.2 47.91,45.37 U1.76
SWDIO
  Top 0.152: U1.72 51.38,40.06 52.58,38.86 56.77,38.86 58.17,40.26 58.17,57.28 57.02,58.42 SV6.4
SWO
  Top 0.152: SV7.1 59.31,63.5 SV6.6
VCC
  Top 0.152: JP1.1 72.77,74.97 R10.2 76.57,67.93 | 76.57,67.93 78.91,65.59 IC3.8 | C15.1 76.58,67.94 76.57,67.93

### Text on the board
tStop: eceboi_v1.2